# Altium schematic sheet ADC.SchDoc
size A; SheetNumber: 3; SheetTotal: 5
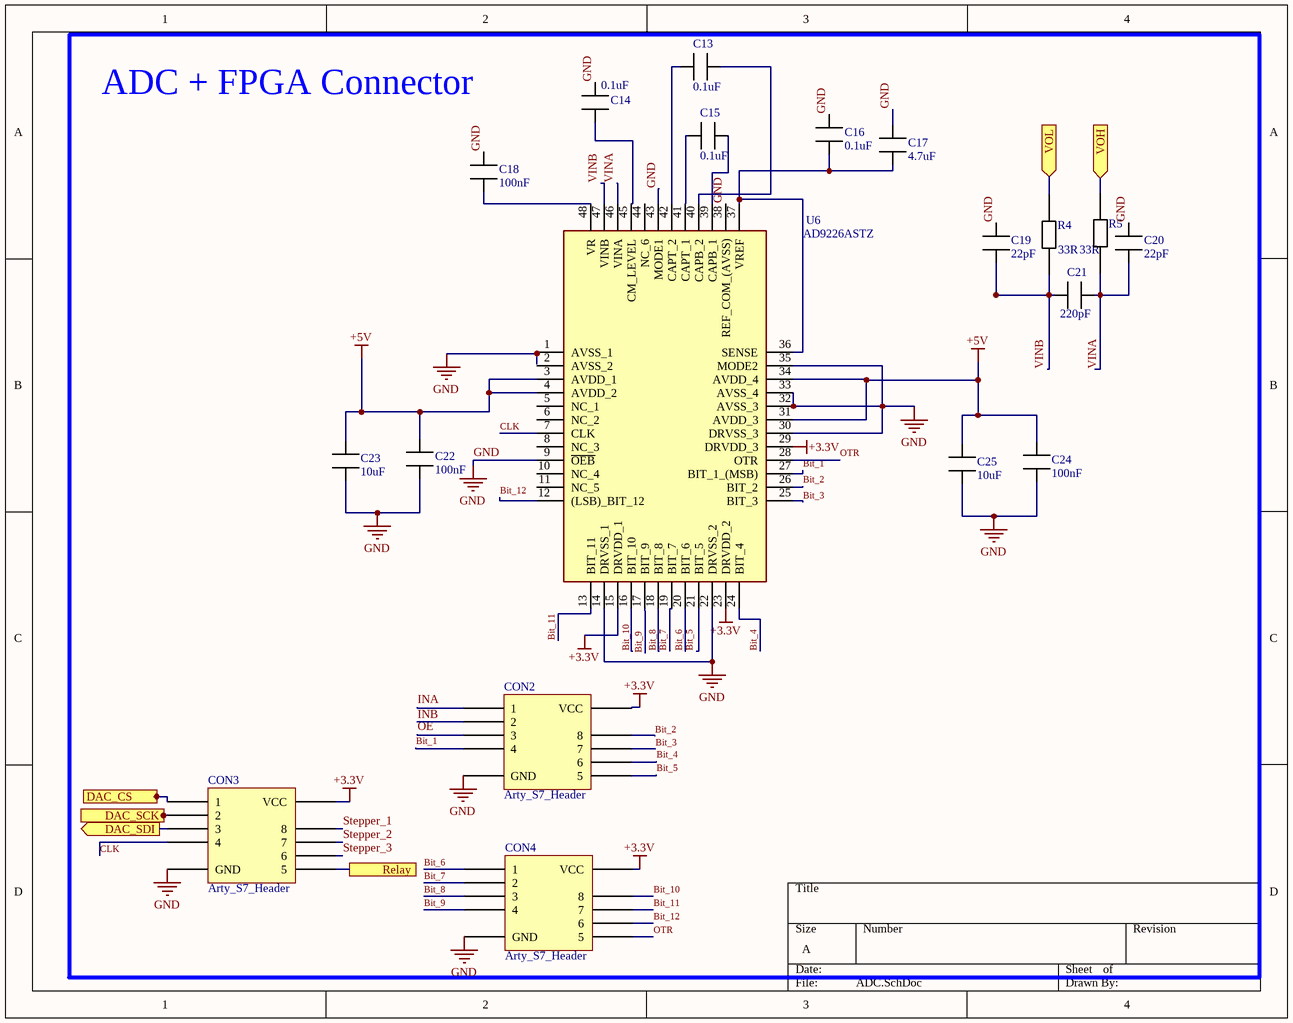
[diagram p0: ADC.SchDoc]

## Parts
C13  0.1uF  [CAP_0805]
C14  0.1uF  [CAP_0805]
C15  0.1uF  [CAP_0805]
C16  0.1uF  [CAP_0805]
C17  4.7uF  [CAP_0805]
C18  100nF  [CAP_0805]
C19  22pF  [CAP_0805]
C20  22pF  [CAP_0805]
C21  220pF  [CAP_0805]
C22  100nF  [CAP_0805]
C23  10uF  [CAP_0805]
C24  100nF  [CAP_0805]
C25  10uF  [CAP_0805]
CON2  Arty_S7_Header  [CON_2x6_2.54MM_THT]
CON3  Arty_S7_Header  [CON_2x6_2.54MM_THT]
CON4  Arty_S7_Header  [CON_2x6_2.54MM_THT]
R4  33R  [RES_0805]
R5  33R  [RES_0805]
U6  AD9226ASTZ  [QFP50P900X900X160-48N]

## Ports
DAC_CS (out), DAC_SCK (out), DAC_SDI (out), Relay, VOH (in), VOL (in)

## Nets
+3.3V: CON2.6(VCC) CON3.6(VCC) CON4.6(VCC) U6.15(DRVDD_1) U6.23(DRVDD_2) U6.29(DRVDD_3)
+5V: C22.1 C23.2 C24.1 C25.2 U6.3(AVDD_1) U6.4(AVDD_2) U6.31(AVDD_3) U6.34(AVDD_4)
GND: C14.1 C16.1 C17.1 C18.1 C19.1 C20.1 C22.2 C23.1 C24.2 C25.1 CON2.5(GND) CON3.5(GND) CON4.5(GND) U6.1(AVSS_1) U6.9(~{OEB}) U6.14(DRVSS_1) U6.22(DRVSS_2) U6.30(DRVSS_3) U6.32(AVSS_3) U6.33(AVSS_4) U6.35(MODE2) U6.38(REF_COM_(AVSS)) U6.43(MODE1)
Bit_1: CON2.4 U6.27(BIT_1_(MSB))
Bit_2: CON2.10(8) U6.26(BIT_2)
Bit_3: CON2.9(7) U6.25(BIT_3)
Bit_4: CON2.8(6) U6.24(BIT_4)
Bit_5: CON2.7(5) U6.21(BIT_5)
Bit_6: CON4.1 U6.20(BIT_6)
Bit_7: CON4.2 U6.19(BIT_7)
Bit_8: CON4.3 U6.18(BIT_8)
Bit_9: CON4.4 U6.17(BIT_9)
Bit_10: CON4.10(8) U6.16(BIT_10)
Bit_11: CON4.9(7) U6.13(BIT_11)
Bit_12: CON4.8(6) U6.12((LSB)_BIT_12)
CLK: CON3.4 U6.7(CLK)
DAC_CS: CON3.1 ; port DAC_CS
DAC_SCK: CON3.2 ; port DAC_SCK
DAC_SDI: CON3.3 ; port DAC_SDI
INA: CON2.1
INB: CON2.2
OE: CON2.3
OTR: CON4.7(5) U6.28(OTR)
Relay: CON3.7(5) ; port Relay
Stepper_1: CON3.10(8)
Stepper_2: CON3.9(7)
Stepper_3: CON3.8(6)
VINA: C20.2 C21.2 R5.1 U6.46(VINA)
VINB: C19.2 C21.1 R4.1 U6.47(VINB)
VOH: R5.2 ; port VOH
VOL: R4.2 ; port VOL
NetC13_1: C13.1 U6.42(CAPT_2)
NetC13_2: C13.2 U6.40(CAPB_2)
NetC14_2: C14.2 U6.45(CM_LEVEL)
NetC15_1: C15.1 U6.41(CAPT_1)
NetC15_2: C15.2 U6.39(CAPB_1)
NetC16_2: C16.2 C17.2 U6.36(SENSE) U6.37(VREF)
NetC18_2: C18.2 U6.48(VR)

Not connected (* = marked no-connect by the designer): U6 2(AVSS_2) 5(NC_1) 6(NC_2) 8(NC_3) 10(NC_4) 11(NC_5) 44(NC_6)

## Notes on the sheet
- ADC + FPGA Connector

## Library data of the parts
C13-C25 = CAP_0805: note: any manufacturer
  C13-C16: val: 0.1uF
  C17: val: 4.7uF
  C18 C22 C24: val: 100nF
  C19 C20: val: 22pF
  C21: val: 220pF
  C23 C25: val: 10uF
CON2-CON4 = Arty_S7_Header: pin to pad: 5>5+11 6>6+12
R4 R5 = RES_0805: note: any manufacturer; val: 33R
U6 = AD9226ASTZ: AD9226ASTZ, 12 bit-Bit DAC 65Msps, Parallel, 48-Pin LQFP; Manufacturer_Name: Analog Devices; Geometry.Height: 1.6mm; Manufacturer_Part_Number: AD9226ASTZ; Mouser Part Number: 584-AD9226ASTZ; Mouser Price/Stock: https://www.mouser.co.uk/ProductDetail/Analog-Devices/AD9226ASTZ?qs=%2FtpEQrCGXCz2C6o%252BfI8LqA%3D%3D; Arrow Part Number: AD9226ASTZ; Arrow Price/Stock: https://www.arrow.com/en/products/ad9226astz/analog-devices?utm_currency=USD&region=nac; Datasheet Link: https://datasheet.datasheetarchive.com/originals/distributors/Datasheets-4/DSA-70171.pdf